# EAGLE design USB-PS2 (EAGLE 7.1.0)
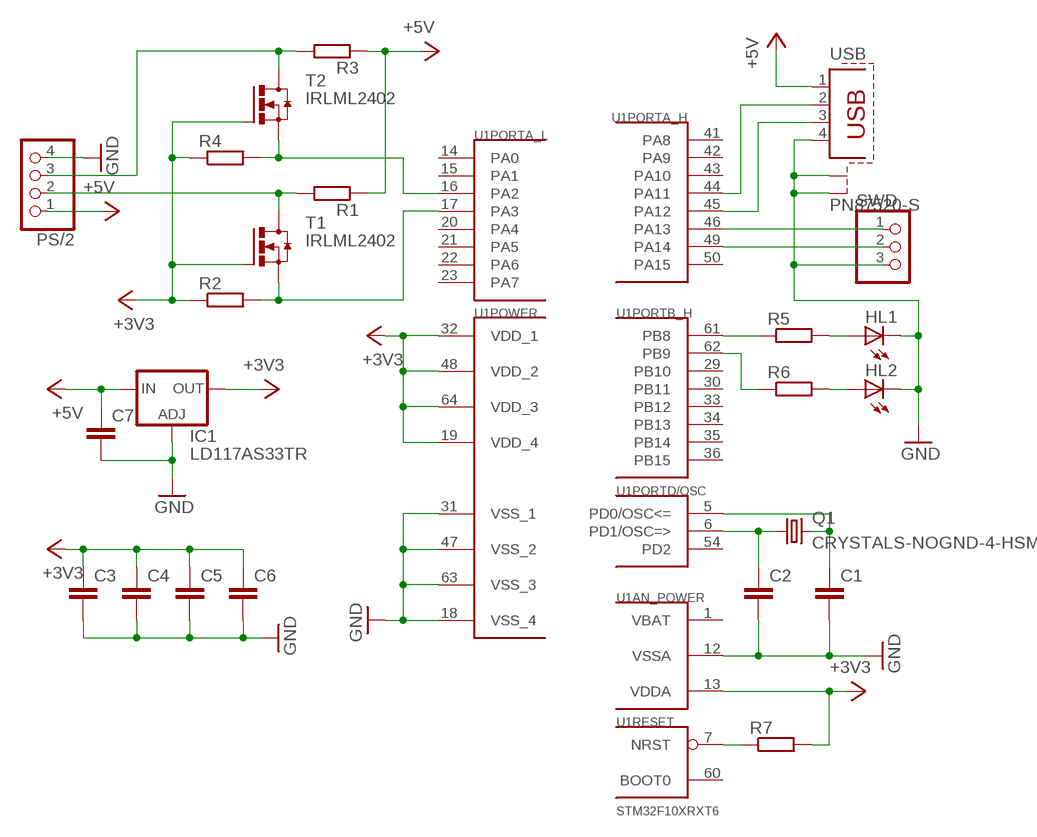
[diagram p0: schematic, sheet 1]

## Parts
C1  C-EUC0603K  [C0603K]
C2  C-EUC0603K  [C0603K]
C3  C-EUC0603K  [C0603K]
C4  C-EUC0603K  [C0603K]
C5  C-EUC0603K  [C0603K]
C6  C-EUC0603K  [C0603K]
C7  C-EUC0603K  [C0603K]
HL1  LEDSML0805  [SML0805]
HL2  LEDSML0805  [SML0805]
IC1  LD117AS33TR  [SOT223]
PS/2  PINHD-1X4  [1X04]
Q1  CRYSTALS-NOGND-4-HSMX  [HC49-4-HSMX]
R1  R-EU_R0603  [R0603]
R2  R-EU_R0603  [R0603]
R3  R-EU_R0603  [R0603]
R4  R-EU_R0603  [R0603]
R5  R-EU_R0603  [R0603]
R6  R-EU_R0603  [R0603]
R7  R-EU_R0603  [R0603]
SWD  PINHD-1X3  [1X03]
T1  IRLML2402  [MICRO3]
T2  IRLML2402  [MICRO3]
U1  STM32F10XRXT6  [TQFP64]
USB  PN87520-S  [PN87520-S]

## Nets
+3V3: C3.1 C4.1 C5.1 C6.1 IC1.4(OUT) R2.1 R4.1 R7.2 T1.1(G) T2.1(G) U1.13(AN_POWER:VDDA) U1.19(POWER:VDD_4) U1.32(POWER:VDD_1) U1.48(POWER:VDD_2) U1.64(POWER:VDD_3)
+5V: C7.1 IC1.3(IN) PS/2.1 R1.1 R3.1 USB.1
GND: C1.2 C2.2 C3.2 C4.2 C5.2 C6.2 C7.2 HL1.C HL2.C IC1.1(ADJ) PS/2.4 SWD.3 U1.12(AN_POWER:VSSA) U1.18(POWER:VSS_4) U1.31(POWER:VSS_1) U1.47(POWER:VSS_2) U1.63(POWER:VSS_3) USB.4 USB.S1 USB.S2
N$1: U1.44(PORTA_H:PA11) USB.2
N$2: U1.45(PORTA_H:PA12) USB.3
N$3: R5.1 U1.61(PORTB_H:PB8)
N$4: C1.1 Q1.2 U1.5(PORTD/OSC:PD0/OSC<=)
N$5: HL1.A R5.2
N$6: HL2.A R6.2
N$7: R6.1 U1.62(PORTB_H:PB9)
N$8: C2.1 Q1.1 U1.6(PORTD/OSC:PD1/OSC=>)
N$9: R7.1 U1.7(RESET:NRST)
N$16: R2.2 T1.2(S) U1.17(PORTA_L:PA3)
N$17: R4.2 T2.2(S) U1.16(PORTA_L:PA2)
PS2_CLK: PS/2.2 R1.2 T1.3(D)
PS2_DAT: PS/2.3 R3.2 T2.3(D)
SWCLK: SWD.2 U1.49(PORTA_H:PA14)
SWDIO: SWD.1 U1.46(PORTA_H:PA13)
Unconnected: U1.2(PORTC_H:PC13) U1.3(PORTC_H:PC14) U1.4(PORTC_H:PC15) U1.8(PORTC_L:PC0) U1.9(PORTC_L:PC1) U1.10(PORTC_L:PC2) U1.11(PORTC_L:PC3) U1.14(PORTA_L:PA0) U1.15(PORTA_L:PA1) U1.20(PORTA_L:PA4) U1.21(PORTA_L:PA5) U1.22(PORTA_L:PA6) U1.23(PORTA_L:PA7) U1.24(PORTC_L:PC4) U1.25(PORTC_L:PC5) U1.26(PORTB_L:PB0) U1.27(PORTB_L:PB1) U1.28(PORTB_L:PB2) U1.29(PORTB_H:PB10) U1.30(PORTB_H:PB11) U1.33(PORTB_H:PB12) U1.34(PORTB_H:PB13) U1.35(PORTB_H:PB14) U1.36(PORTB_H:PB15) U1.37(PORTC_L:PC6) U1.38(PORTC_L:PC7) U1.39(PORTC_H:PC8) U1.40(PORTC_H:PC9) U1.41(PORTA_H:PA8) U1.42(PORTA_H:PA9) U1.43(PORTA_H:PA10) U1.50(PORTA_H:PA15) U1.51(PORTC_H:PC10) U1.52(PORTC_H:PC11) U1.53(PORTC_H:PC12) U1.54(PORTD/OSC:PD2) U1.55(PORTB_L:PB3) U1.56(PORTB_L:PB4) U1.57(PORTB_L:PB5) U1.58(PORTB_L:PB6) U1.59(PORTB_L:PB7) U1.60(RESET:BOOT0)

## Power pins joined to a net without a drawn wire
VBAT: U1.1(AN_POWER:VBAT)

## Library data of the parts
C1-C7 = rcl:C-EU: CAPACITOR, European symbol
HL1 HL2 = led:LED: LED OSRAM: - CHIPLED LG R971, LG N971, LY N971, LG Q971, LY Q971, LO R971, LY R971 LH N974, LH R974 LS Q976, LO Q976, LY Q976 LO Q996 - Hyper CHIPLED LW Q18S LB Q993, LB Q99A, LB R99A - SideLED LS A670, LO A670, LY A670, LG A670, LP A670 LB A673, LV A673, LT A673, LW A673 LH A674 LY A675 LS A676, LA A676, LO A676, LY A676, LW A676 LS A679, LY A679, LG A679 - Hyper Micro SIDELED® LS Y876, LA Y876, LO Y876, LY Y876 LT Y87S - SmartLED LW L88C, LW L88S LB L89C, LB L89S, LG L890 LS L89K, LO L89K, LY L89K LS L896, LA L896, LO L896, LY L896 - TOPLED LS T670, LO T670, LY T670, LG T670, LP T670 LSG T670, LSP T670, LSY T670, LOP T670, LYG T670 LG T671, LOG T671, LSG T671 LB T673, LV T673, LT T673, LW T673 LH T674 LS T676, LA T676, LO T676, LY T676, LB T676, LH T676, LSB T676, LW T676 LB T67C, LV T67C, LT T67C, LS T67K, LO T67K, LY T67K, LW E67C LS E67B, LA E67B, LO E67B, LY E67B, LB E67C, LV E67C, LT E67C LW T67C LS T679, LY T679, LG T679 LS T770, LO T770, LY T770, LG T770, LP T770 LB T773, LV T773, LT T773, LW T773 LH T774 LS E675, LA E675, LY E675, LS T675 LS T776, LA T776, LO T776, LY T776, LB T776 LHGB T686 LT T68C, LB T68C - Hyper Mini TOPLED® LB M676 - Mini TOPLED Santana® LG M470 LS M47K, LO M47K, LY M47K Source: http://www.osram.convergy.de LUXEON: - LUMILED® LXK2-PW12-R00, LXK2-PW12-S00, LXK2-PW14-U00, LXK2-PW14-V00 LXK2-PM12-R00, LXK2-PM12-S00, LXK2-PM14-U00 LXK2-PE12-Q00, LXK2-PE12-R00, LXK2-PE12-S00, LXK2-PE14-T00, LXK2-PE14-U00 LXK2-PB12-K00, LXK2-PB12-L00, LXK2-PB12-M00, LXK2-PB14-N00, LXK2-PB14-P00, LXK2-PB14-Q00 LXK2-PR12-L00, LXK2-PR12-M00, LXK2-PR14-Q00, LXK2-PR14-R00 LXK2-PD12-Q00, LXK2-PD12-R00, LXK2-PD12-S00 LXK2-PH12-R00, LXK2-PH12-S00 LXK2-PL12-P00, LXK2-PL12-Q00, LXK2-PL12-R00 Source: www.luxeon.com KINGBRIGHT: KA-3528ASYC Source: www.kingbright.com
IC1 = v-reg:LD117A?*: Low drop fixed and adjustable positive voltage regulators 1 A Source: http://www.st.com/stonline/products/literature/ds/7194/ld1117axx.pdf
PS/2 = pinhead:PINHD-1X4: PIN HEADER
Q1 = IQD-Frequency-Products:CRYSTALS-NOGND: CRYSTALS CAN NOT GROUNDED
R1-R7 = rcl:R-EU_: RESISTOR, European symbol
SWD = pinhead:PINHD-1X3: PIN HEADER
T1 T2 = transistor-power:IRLML2402
U1 = stm32:STM32F10XRXT6: STM32F101/103 64pin LQFP
USB = con-berg:PN87520-S; OC_FARNELL: unknown; OC_NEWARK: unknown

## Board
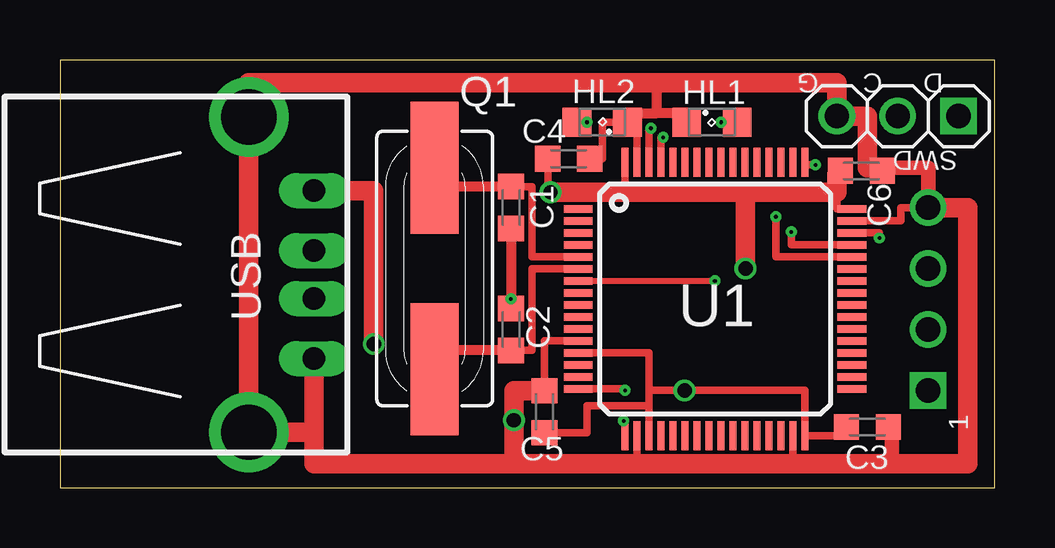
[diagram p1: board, top side]
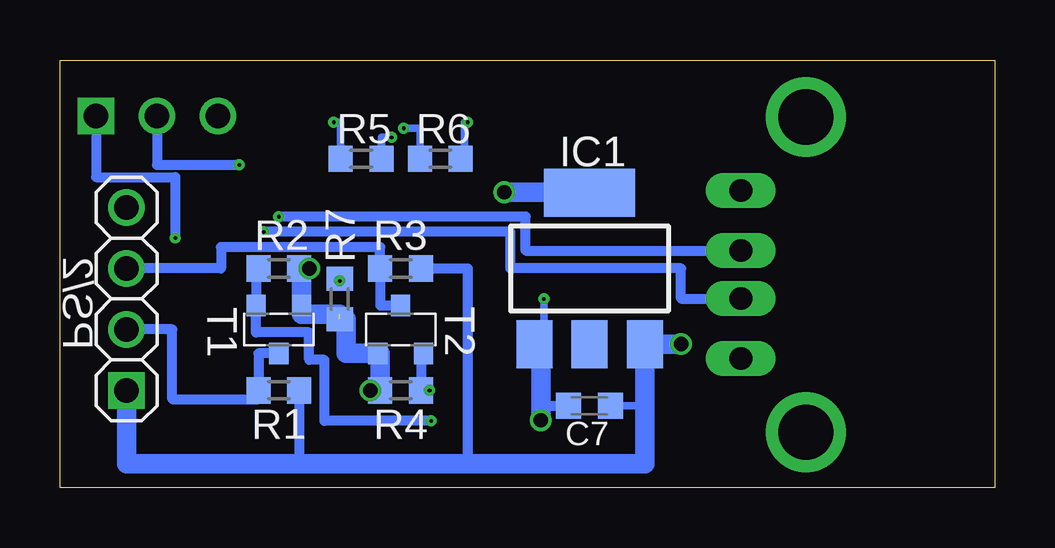
[diagram p2: board, bottom side, seen from below]

Size 38.97 x 17.83 mm. Coordinates in mm from the lower left corner, seen from the top.
Outline: 0,0 38.97,0 38.97,17.83 0,17.83 0,0
Copper layers (1*16): Top 0.035mm / dielectric 1.5mm / Bottom 0.035mm
Design rules "SeeedStudio_2layer_DRU_no_angle_20140221": minimum track width 6mil, minimum drill 12mil, track to track 6mil, track to pad 6mil, pad to pad 6mil, via to via 6mil, smd to smd 0mil, copper to edge 10mil, drill to drill 10mil, minimum pad ring 10mil, minimum via ring 6mil, stop-mask expansion 2mil, vias tented up to drill 100mil, thermal gap 10mil

### Footprints (pad centres in the part's own frame; a part is rotated, then mirrored left to right if it is on the bottom)
C0603K = smd 1.05 x 1.08: 1 -0.875,0; 2 0.875,0
SML0805 = smd 1.2 x 1.2: A 1.05,0; C -1.05,0
SOT223 = smd 1.5 x 2: 1 -2.3,-3.15; 2 0,-3.15; 3 2.3,-3.15 | smd 3.8 x 2: 4 0,3.15
1X04 = drill 1.016 square: 1 -3.81,0 | drill 1.016: 2 -1.27,0; 3 1.27,0; 4 3.81,0
HC49-4-HSMX = smd 5.5 x 2: 1 -4.2,0; 2 4.2,0
R0603 = smd 1 x 1.1: 1 -0.85,0; 2 0.85,0
1X03 = drill 1.016 square: 1 -2.54,0 | drill 1.016: 2 0,0; 3 2.54,0
MICRO3 = smd 0.8 x 0.9: 1 -0.95,-1; 2 0.95,-1; 3 0,1
TQFP64 = smd 1.2 x 0.3: 1 -5.7,3.75; 2 -5.7,3.25; 3 -5.7,2.75; 4 -5.7,2.25; 5 -5.7,1.75; 6 -5.7,1.25; 7 -5.7,0.75; 8 -5.7,0.25; 9 -5.7,-0.25; 10 -5.7,-0.75; 11 -5.7,-1.25; 12 -5.7,-1.75; 13 -5.7,-2.25; 14 -5.7,-2.75; 15 -5.7,-3.25; 16 -5.7,-3.75; 33 5.7,-3.75; 34 5.7,-3.25; 35 5.7,-2.75; 36 5.7,-2.25; 37 5.7,-1.75; 38 5.7,-1.25; 39 5.7,-0.75; 40 5.7,-0.25; 41 5.7,0.25; 42 5.7,0.75; 43 5.7,1.25; 44 5.7,1.75; 45 5.7,2.25; 46 5.7,2.75; 47 5.7,3.25; 48 5.7,3.75 | smd 0.3 x 1.2: 17 -3.75,-5.7; 18 -3.25,-5.7; 19 -2.75,-5.7; 20 -2.25,-5.7; 21 -1.75,-5.7; 22 -1.25,-5.7; 23 -0.75,-5.7; 24 -0.25,-5.7; 25 0.25,-5.7; 26 0.75,-5.7; 27 1.25,-5.7; 28 1.75,-5.7; 29 2.25,-5.7; 30 2.75,-5.7; 31 3.25,-5.7; 32 3.75,-5.7; 49 3.75,5.7; 50 3.25,5.7; 51 2.75,5.7; 52 2.25,5.7; 53 1.75,5.7; 54 1.25,5.7; 55 0.75,5.7; 56 0.25,5.7; 57 -0.25,5.7; 58 -0.75,5.7; 59 -1.25,5.7; 60 -1.75,5.7; 61 -2.25,5.7; 62 -2.75,5.7; 63 -3.25,5.7; 64 -3.75,5.7
PN87520-S = drill 0.95 long: 1 -3.5,2.71; 2 -1,2.71; 3 1,2.71; 4 3.5,2.71 | drill 2.3 pad 2.9: S1 -6.57,0; S2 6.57,0

### Placement (x,y rotation side)
C1  18.8,11.68 270 top
C2  18.8,6.6 90 top
C3  33.66,2.54 0 top
C4  21.21,13.72 0 top
C5  20.19,3.17 90 top
C6  33.4,13.21 0 top
C7  16.89,3.43 180 bottom
HL1  27.18,15.24 0 top
HL2  22.61,15.24 180 top
IC1  16.89,9.14 0 bottom
PS/2  36.2,7.87 90 bottom
Q1  15.62,9.14 90 top
R1  29.84,4.06 180 bottom
R2  29.84,9.14 180 bottom
R3  24.77,9.14 180 bottom
R4  24.77,4.06 0 bottom
R5  26.42,13.72 180 bottom
R6  23.11,13.72 0 bottom
R7  27.3,7.87 270 bottom
SWD  34.92,15.49 180 top
T1  29.84,6.6 180 bottom
T2  24.77,6.6 0 bottom
U1  27.3,7.87 0 top
USB  7.87,8.89 270 top

### Tracks (layer width: path | path; a pad name or v marks a point on that pad's centre or on a via)
+3V3  (via drill 0.6)  (1 unrouted)
  Top 0.305: 24.55,4.06 v26.04,4.06 31.05,4.06 U1.32 32.78,2.17 C3.1 | 24.55,4.06 24.55,3.43 | 24.55,3.43 U1.19 | U1.13 24.55,5.62 24.55,4.06 | U1.48 32.38,11.62 32.38,12.32 | 23.5,12.32 23.55,12.32 U1.64 | C6.1 32.38,13.07 | C5.1 21.97,2.3 21.97,3.43 24.55,3.43 | v20.45,12.32 20.33,12.32 C4.1
  Top 0.406: 20.45,13.97 C4.1
  Top 0.813: v20.45,12.32 23.5,12.32 28.57,12.32 | v28.57,9.14 28.57,12.32 | 28.57,12.32 32.38,12.32 32.38,13.07
  Bottom 0.305: R4.1 v26.04,4.06
  Bottom 0.406: 28.89,9.14 R2.1 v28.57,9.14 | T2.1 25.61,5.6 | T1.1 28.89,7.24
  Bottom 0.61: IC1.4 16.89,12.83 | 27.05,7.02 R7.2
  Bottom 0.813: 28.89,9.14 T1.1 | 25.61,5.6 R4.1 | T2.1 27.05,5.6 27.05,7.02 | 28.89,7.24 27.3,7.24 | 16.89,12.83 17.4,12.32 v20.45,12.32
+5V  (via drill 0.6)
  Top 0.813: v13.08,5.99 13.08,12.39 USB.1
  Bottom 0.305: R3.1 23.91,9.36 | C7.1 14.59,3.43
  Bottom 0.406: R1.1 29,1.02 | R3.1 21.97,9.14 21.97,1.02
  Bottom 0.813: PS/2.1 36.2,1.02 29,1.02 21.97,1.02 14.59,1.02 14.59,3.43 IC1.3 v13.08,5.99
GND  (via drill 0.15, 0.6)
  Top 0.305: C5.2 20.19,6.12 U1.12 | v18.8,7.87 C2.2 | U1.47 35.05,11.12 35.05,11.68 PS/2.4 | C6.2 34.04,13.35 | U1.31 30.55,1.02 30.86,1.02 | U1.18 24.05,1.02 24.51,1.02 | U1.63 24.05,15.24 | 24.05,15.24 HL2.C 22.61,15.24 22.61,13.72 C4.2 | 24.05,15.24 24.05,15.62 | 26.13,15.62 HL1.C | 32.26,16.89 32.38,16.89
  Top 0.406: C1.2 v18.8,7.87 | 24.05,15.62 24.89,15.62 | 26.13,15.62 24.89,15.62 | 24.89,15.62 24.89,16.89
  Top 0.61: v18.92,2.82 18.92,2.79 | 34.04,13.35 36.2,13.34 PS/2.4 | C3.2 34.67,2.16 34.67,1.02
  Top 0.813: PS/2.4 37.85,11.68 37.85,1.02 34.67,1.02 30.86,1.02 24.51,1.02 18.92,1.02 | C5.2 18.92,4.05 18.92,2.79 18.92,1.02 | 18.92,1.02 10.58,1.02 10.58,2.32 | 32.26,16.89 24.89,16.89 7.87,16.89 USB.S1 7.87,2.41 | 32.38,16.89 SWD.3 33.66,15.49 33.66,13.34 34.28,13.34 C6.2 | 10.58,2.32 USB.4 | USB.S2 10.58,2.32
  Bottom 0.305: 19.43,5.99 19.43,5.36 | 19.43,5.36 IC1.1 18.8,5.99 v18.8,7.87 | 19.43,5.36 18.92,5.33
  Bottom 0.406: 18.92,3.43 C7.2
  Bottom 0.61: 19.43,5.99 IC1.1
  Bottom 0.813: 18.92,5.33 18.92,3.43 v18.92,2.82
N$1  (via drill 0.15)
  Top 0.305: v29.84,11.3 29.84,9.62 U1.44
  Bottom 0.406: v29.84,11.3 19.56,11.3 19.56,9.89 USB.2
N$2  (via drill 0.15)
  Top 0.305: v30.48,10.67 30.48,10.12 U1.45
  Bottom 0.406: v30.48,10.67 20.19,10.67 20.19,9.14 13.08,9.14 13.08,7.89 USB.3
N$3  (via drill 0.15)
  Top 0.305: U1.61 25.05,14.61 v25.15,14.61
  Bottom 0.305: R5.1 25.57,14.61 v25.15,14.61
N$4
  Top 0.305: 15.62,11.05 Q1.2 arc90 16.41,12.56 | U1.5 19.68,9.62 19.68,12.56 C1.1
  Top 0.406: C1.1 16.41,12.56
N$5  (via drill 0.15)
  Top 0.305: HL1.A v27.56,15.24
  Bottom 0.305: R5.2 27.27,15.24 v27.56,15.24
N$6  (via drill 0.15)
  Top 0.305: HL2.A v21.97,15.24
  Bottom 0.305: R6.2 22.1,13.72 22.1,15.24 v21.97,15.24
N$7  (via drill 0.15)
  Top 0.305: U1.62 24.55,14.99 v24.64,14.99
  Bottom 0.305: R6.1 23.96,14.99 v24.64,14.99
N$8
  Top 0.305: 16.11,4.46 Q1.1 arc-90 16.41,5.73 | C2.1 19.68,5.73 19.68,9.12 U1.6
  Top 0.406: C2.1 16.41,5.73
N$9  (via drill 0.15)
  Top 0.254: U1.7 v27.3,8.62
  Bottom 0.254: v27.3,8.62 R7.1
N$16  (via drill 0.15)
  Top 0.305: U1.17 23.55,2.79 v23.5,2.79
  Bottom 0.406: R2.2 30.8,9.14 T1.2 30.8,6.48 28.57,6.48 28.57,5.33 27.94,5.33 27.94,2.79 v23.5,2.79
N$17  (via drill 0.15)
  Top 0.305: U1.16 23.56,4.12 v23.56,4.06
  Bottom 0.305: T2.2 23.91,5.6
  Bottom 0.406: v23.56,4.06 R4.2 23.91,5.6
PS2_CLK
  Bottom 0.406: PS/2.2 34.29,6.6 34.29,3.7 30.7,3.7 R1.2 30.7,5.6 T1.3
PS2_DAT
  Bottom 0.406: T2.3 25.61,7.6 R3.2 25.61,10.03 32.26,10.03 32.26,9.14 PS/2.3
SWCLK  (via drill 0.15)
  Top 0.305: v31.5,13.46 31.05,13.46 U1.49
  Bottom 0.406: SWD.2 34.92,13.46 v31.5,13.46
SWDIO  (via drill 0.15)
  Top 0.305: v34.16,10.41 34.16,10.62 U1.46
  Bottom 0.406: SWD.1 37.47,12.95 34.16,12.95 v34.16,10.41

### Text on the board
tNames: G | C | D | 1